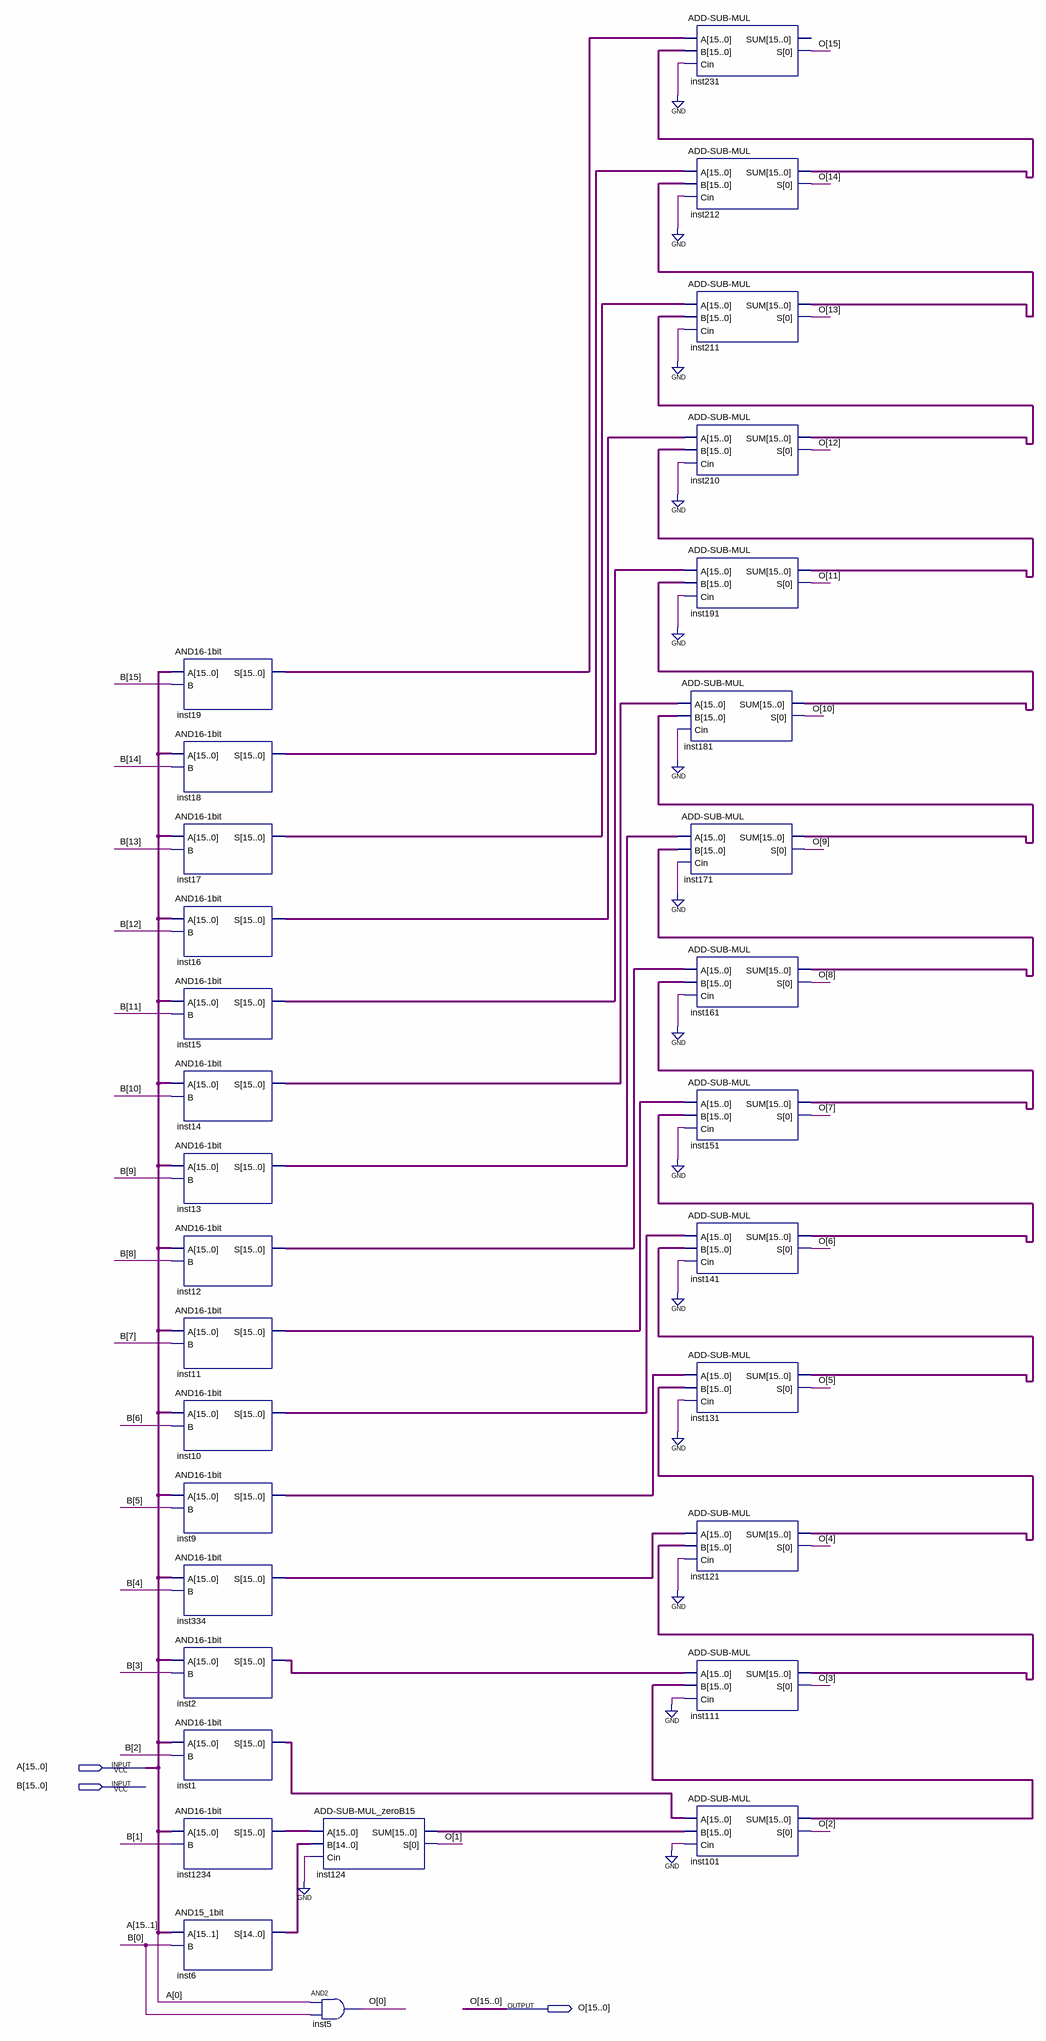
[diagram p0: schematic sheet]
// Quartus schematic MultiplierBlock.bdf as structural Verilog: 32 symbols, 3 pins
module MultiplierBlock (
  input  [15:0] A,
  input  [15:0] B,
  output [15:0] O
);

  wire [14:0] inst6_s;
  wire [15:0] inst1_s, inst2_s, inst9_s, inst10_s, inst11_s, inst12_s, inst13_s, inst14_s, inst15_s,
       inst16_s, inst17_s, inst18_s, inst19_s, inst101_sum, inst111_sum, inst121_sum, inst124_sum,
       inst131_sum, inst141_sum, inst151_sum, inst161_sum, inst171_sum, inst181_sum, inst191_sum,
       inst210_sum, inst211_sum, inst212_sum, inst334_s, inst1234_s;

  \AND16-1bit  inst19 (.A(A), .B(B[15]), .S(inst19_s));
  \AND16-1bit  inst18 (.A(A), .B(B[14]), .S(inst18_s));
  \AND16-1bit  inst17 (.A(A), .B(B[13]), .S(inst17_s));
  \AND16-1bit  inst16 (.A(A), .B(B[12]), .S(inst16_s));
  \AND16-1bit  inst15 (.A(A), .B(B[11]), .S(inst15_s));
  \AND16-1bit  inst14 (.A(A), .B(B[10]), .S(inst14_s));
  \AND16-1bit  inst13 (.A(A), .B(B[9]), .S(inst13_s));
  \AND16-1bit  inst12 (.A(A), .B(B[8]), .S(inst12_s));
  \AND16-1bit  inst11 (.A(A), .B(B[7]), .S(inst11_s));
  \AND16-1bit  inst10 (.A(A), .B(B[6]), .S(inst10_s));
  \AND16-1bit  inst9 (.A(A), .B(B[5]), .S(inst9_s));
  \AND16-1bit  inst334 (.A(A), .B(B[4]), .S(inst334_s));
  \AND16-1bit  inst2 (.A(A), .B(B[3]), .S(inst2_s));
  \AND16-1bit  inst1 (.A(A), .B(B[2]), .S(inst1_s));
  \AND16-1bit  inst1234 (.A(A), .B(B[1]), .S(inst1234_s));
  AND15_1bit inst6 (.A(A[15:1]), .B(B[0]), .S(inst6_s));
  \ADD-SUB-MUL_zeroB15  inst124 (.A(inst1234_s), .B(inst6_s), .Cin(1'b0), .SUM(inst124_sum), .S(O[1]));
  and inst5 (O[0], A[0], B[0]);
  \ADD-SUB-MUL  inst231 (.A(inst19_s), .B(inst212_sum), .Cin(1'b0), .S(O[15]));  // open: SUM
  \ADD-SUB-MUL  inst212 (.A(inst18_s), .B(inst211_sum), .Cin(1'b0), .SUM(inst212_sum), .S(O[14]));
  \ADD-SUB-MUL  inst211 (.A(inst17_s), .B(inst210_sum), .Cin(1'b0), .SUM(inst211_sum), .S(O[13]));
  \ADD-SUB-MUL  inst210 (.A(inst16_s), .B(inst191_sum), .Cin(1'b0), .SUM(inst210_sum), .S(O[12]));
  \ADD-SUB-MUL  inst191 (.A(inst15_s), .B(inst181_sum), .Cin(1'b0), .SUM(inst191_sum), .S(O[11]));
  \ADD-SUB-MUL  inst181 (.A(inst14_s), .B(inst171_sum), .Cin(1'b0), .SUM(inst181_sum), .S(O[10]));
  \ADD-SUB-MUL  inst171 (.A(inst13_s), .B(inst161_sum), .Cin(1'b0), .SUM(inst171_sum), .S(O[9]));
  \ADD-SUB-MUL  inst161 (.A(inst12_s), .B(inst151_sum), .Cin(1'b0), .SUM(inst161_sum), .S(O[8]));
  \ADD-SUB-MUL  inst151 (.A(inst11_s), .B(inst141_sum), .Cin(1'b0), .SUM(inst151_sum), .S(O[7]));
  \ADD-SUB-MUL  inst141 (.A(inst10_s), .B(inst131_sum), .Cin(1'b0), .SUM(inst141_sum), .S(O[6]));
  \ADD-SUB-MUL  inst131 (.A(inst9_s), .B(inst121_sum), .Cin(1'b0), .SUM(inst131_sum), .S(O[5]));
  \ADD-SUB-MUL  inst121 (.A(inst334_s), .B(inst111_sum), .Cin(1'b0), .SUM(inst121_sum), .S(O[4]));
  \ADD-SUB-MUL  inst111 (.A(inst2_s), .B(inst101_sum), .Cin(1'b0), .SUM(inst111_sum), .S(O[3]));
  \ADD-SUB-MUL  inst101 (.A(inst1_s), .B(inst124_sum), .Cin(1'b0), .SUM(inst101_sum), .S(O[2]));
endmodule
